# EAGLE schematic LEDboard (EAGLE 7.6.0)
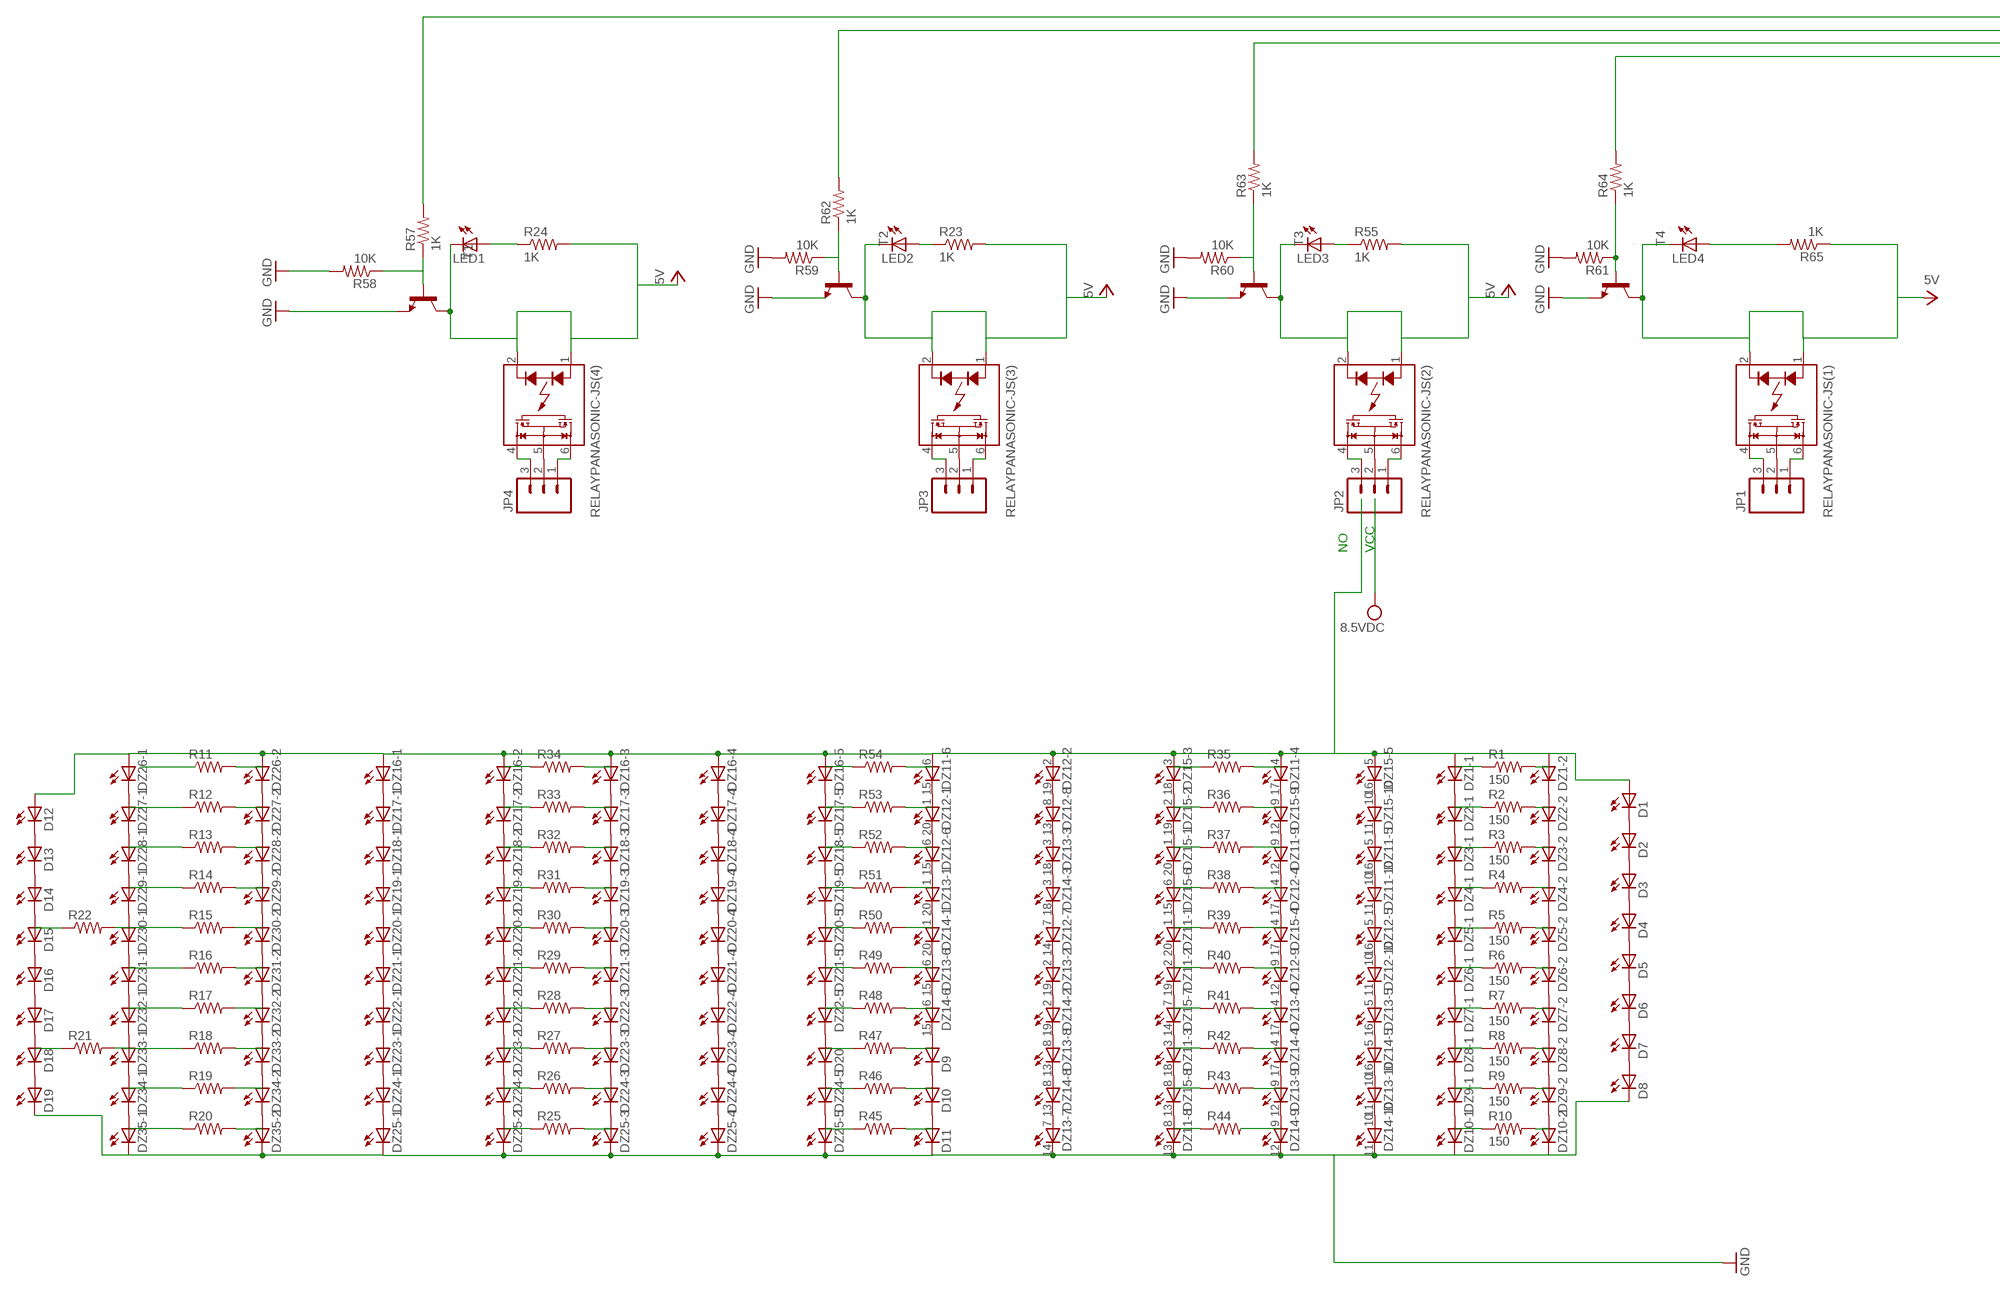
[diagram p0: schematic, sheet 1, part 1 of 2]
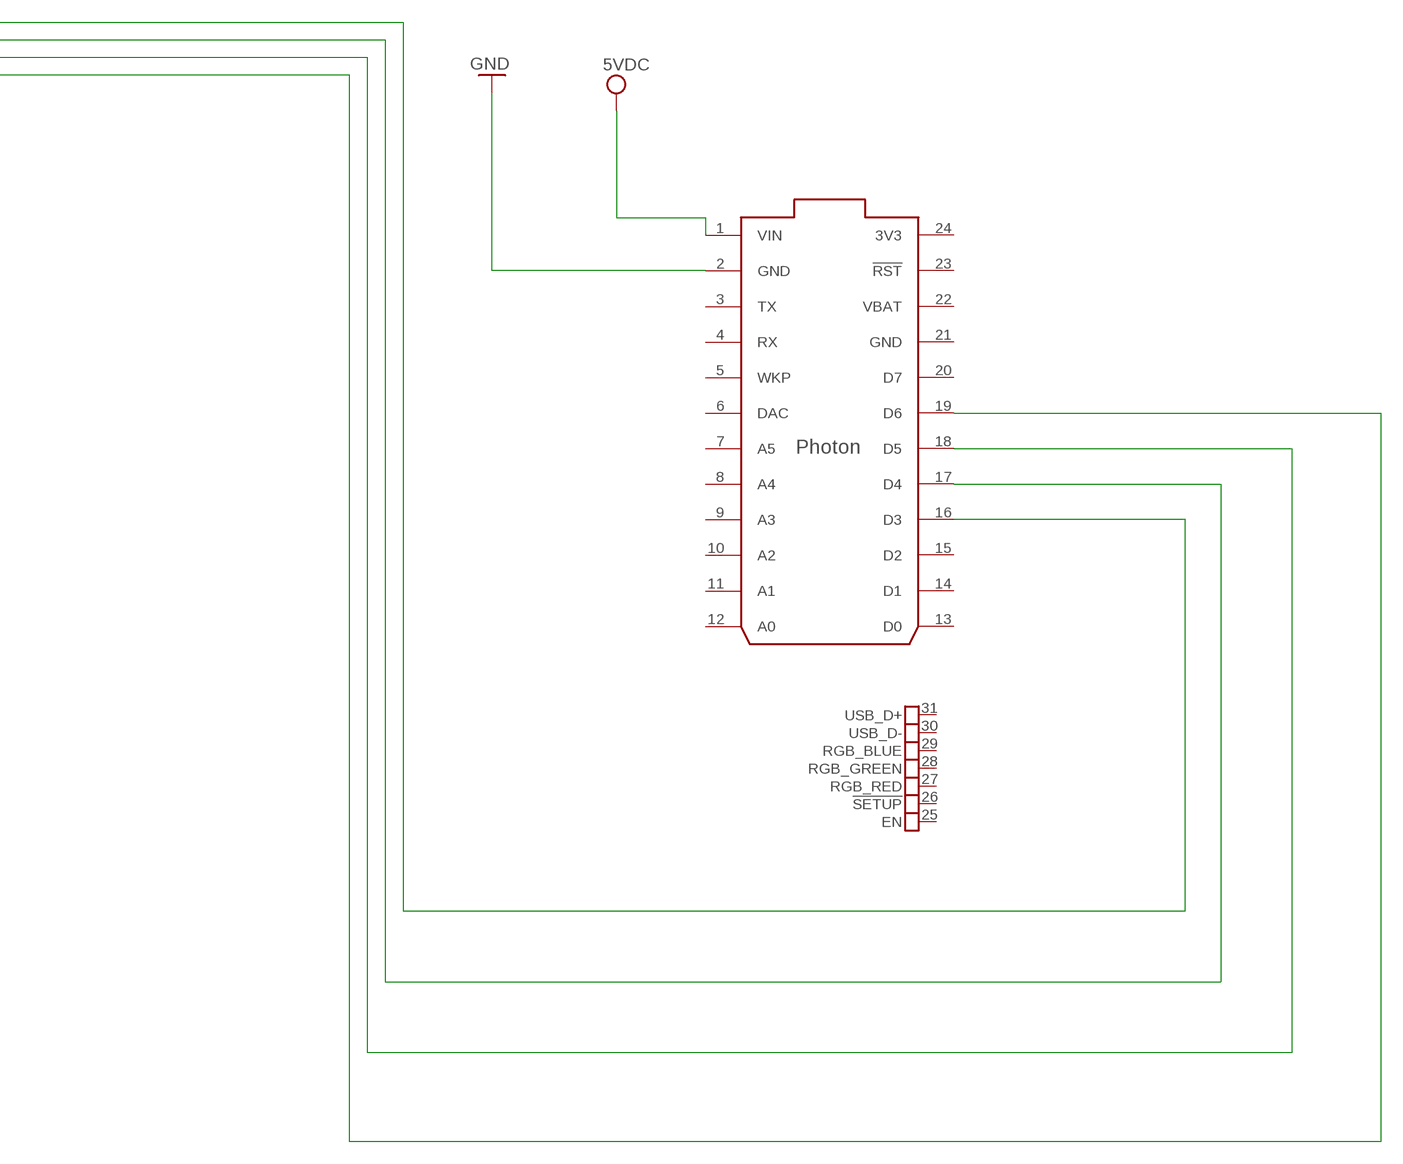
[diagram p1: schematic, sheet 1, part 2 of 2]

## Parts
D1  U57X32  [U57X32]
D2  U57X32  [U57X32]
D3  U57X32  [U57X32]
D4  U57X32  [U57X32]
D5  U57X32  [U57X32]
D6  U57X32  [U57X32]
D7  U57X32  [U57X32]
D8  U57X32  [U57X32]
D9  U57X32  [U57X32]
D10  U57X32  [U57X32]
D11  U57X32  [U57X32]
D12  U57X32  [U57X32]
D13  U57X32  [U57X32]
D14  U57X32  [U57X32]
D15  U57X32  [U57X32]
D16  U57X32  [U57X32]
D17  U57X32  [U57X32]
D18  U57X32  [U57X32]
D19  U57X32  [U57X32]
D20  U57X32  [U57X32]
DZ1  LZR182  [LZR182]
DZ2  LZR182  [LZR182]
DZ3  LZR182  [LZR182]
DZ4  LZR182  [LZR182]
DZ5  LZR182  [LZR182]
DZ6  LZR182  [LZR182]
DZ7  LZR182  [LZR182]
DZ8  LZR182  [LZR182]
DZ9  LZR182  [LZR182]
DZ10  LZR182  [LZR182]
DZ11  LB10  [LB10]
DZ12  LB10  [LB10]
DZ13  LB10  [LB10]
DZ14  LB10  [LB10]
DZ15  LB10  [LB10]
DZ16  LZR185  [LZR185]
DZ17  LZR185  [LZR185]
DZ18  LZR185  [LZR185]
DZ19  LZR185  [LZR185]
DZ20  LZR185  [LZR185]
DZ21  LZR185  [LZR185]
DZ22  LZR185  [LZR185]
DZ23  LZR185  [LZR185]
DZ24  LZR185  [LZR185]
DZ25  LZR185  [LZR185]
DZ26  LZR182  [LZR182]
DZ27  LZR182  [LZR182]
DZ28  LZR182  [LZR182]
DZ29  LZR182  [LZR182]
DZ30  LZR182  [LZR182]
DZ31  LZR182  [LZR182]
DZ32  LZR182  [LZR182]
DZ33  LZR182  [LZR182]
DZ34  LZR182  [LZR182]
DZ35  LZR182  [LZR182]
JP1  M03  [03P]
JP2  M03  [03P]
JP3  M03  [03P]
JP4  M03  [03P]
LED1  LEDLUMILED  [LUMILED]
LED2  LEDLUMILED  [LUMILED]
LED3  LEDLUMILED  [LUMILED]
LED4  LEDLUMILED  [LUMILED]
R1  150  R-US_0204/2V  [0204V]
R2  150  R-US_0204/2V  [0204V]
R3  150  R-US_0204/2V  [0204V]
R4  R-US_0204/2V  [0204V]
R5  150  R-US_0204/2V  [0204V]
R6  150  R-US_0204/2V  [0204V]
R7  150  R-US_0204/2V  [0204V]
R8  150  R-US_0204/2V  [0204V]
R9  150  R-US_0204/2V  [0204V]
R10  150  R-US_0204/2V  [0204V]
R11  R-US_0204/2V  [0204V]
R12  R-US_0204/2V  [0204V]
R13  R-US_0204/2V  [0204V]
R14  R-US_0204/2V  [0204V]
R15  R-US_0204/2V  [0204V]
R16  R-US_0204/2V  [0204V]
R17  R-US_0204/2V  [0204V]
R18  R-US_0204/2V  [0204V]
R19  R-US_0204/2V  [0204V]
R20  R-US_0204/2V  [0204V]
R21  R-US_0204/2V  [0204V]
R22  R-US_0204/2V  [0204V]
R23  1K  R-US_0204/2V  [0204V]
R24  1K  R-US_0204/2V  [0204V]
R25  R-US_0204/2V  [0204V]
R26  R-US_0204/2V  [0204V]
R27  R-US_0204/2V  [0204V]
R28  R-US_0204/2V  [0204V]
R29  R-US_0204/2V  [0204V]
R30  R-US_0204/2V  [0204V]
R31  R-US_0204/2V  [0204V]
R32  R-US_0204/2V  [0204V]
R33  R-US_0204/2V  [0204V]
R34  R-US_0204/2V  [0204V]
R35  R-US_0204/2V  [0204V]
R36  R-US_0204/2V  [0204V]
R37  R-US_0204/2V  [0204V]
R38  R-US_0204/2V  [0204V]
R39  R-US_0204/2V  [0204V]
R40  R-US_0204/2V  [0204V]
R41  R-US_0204/2V  [0204V]
R42  R-US_0204/2V  [0204V]
R43  R-US_0204/2V  [0204V]
R44  R-US_0204/2V  [0204V]
R45  R-US_0204/2V  [0204V]
R46  R-US_0204/2V  [0204V]
R47  R-US_0204/2V  [0204V]
R48  R-US_0204/2V  [0204V]
R49  R-US_0204/2V  [0204V]
R50  R-US_0204/2V  [0204V]
R51  R-US_0204/2V  [0204V]
R52  R-US_0204/2V  [0204V]
R53  R-US_0204/2V  [0204V]
R54  R-US_0204/2V  [0204V]
R55  1K  R-US_0204/2V  [0204V]
R57  1K  R-US_0204/2V  [0204V]
R58  10K  R-US_0204/2V  [0204V]
R59  10K  R-US_0204/2V  [0204V]
R60  10K  R-US_0204/2V  [0204V]
R61  10K  R-US_0204/2V  [0204V]
R62  1K  R-US_0204/2V  [0204V]
R63  1K  R-US_0204/2V  [0204V]
R64  1K  R-US_0204/2V  [0204V]
R65  1K  R-US_0204/2V  [0204V]
RELAYPANASONIC-JS(1)  AQV10  [DIL06]
RELAYPANASONIC-JS(2)  AQV10  [DIL06]
RELAYPANASONIC-JS(3)  AQV10  [DIL06]
RELAYPANASONIC-JS(4)  AQV10  [DIL06]
T1  -NPN-SOT93V  [SOT93V]
T2  -NPN-SOT93V  [SOT93V]
T3  -NPN-SOT93V  [SOT93V]
T4  -NPN-SOT93V  [SOT93V]
U$1  PHOTON_SMD  [PHOTON_SMD]

## Nets
GND: D8.K(C) D11.K(C) D19.K(C) DZ10.K1(-1:C) DZ10.K2(-2:C) DZ11.13(-8:C) DZ13.14(-7:C) DZ14.11(-10:C) DZ14.12(-9:C) DZ25.K1(-1:C) DZ25.K2(-2:C) DZ25.K3(-3:C) DZ25.K4(-4:C) DZ25.K5(-5:C) DZ35.K1(-1:C) DZ35.K2(-2:C) R58.2 R59.2 R60.2 R61.2 T1.E T3.E T4.E U$1.2(GND)
N$1: D1.K(C) D2.A
N$2: D2.K(C) D3.A
N$3: D3.K(C) D4.A
N$4: D4.K(C) D5.A
N$5: D5.K(C) D6.A
N$6: D6.K(C) D7.A
N$7: D7.K(C) D8.A
N$8: R35.1
N$9: DZ1.K1(-1:C) DZ2.A1(-1:A)
N$10: DZ1.K2(-2:C) DZ2.A2(-2:A)
N$11: DZ2.K1(-1:C) DZ3.A1(-1:A)
N$12: DZ2.K2(-2:C) DZ3.A2(-2:A)
N$13: DZ3.K1(-1:C) DZ4.A1(-1:A)
N$14: DZ3.K2(-2:C) DZ4.A2(-2:A)
N$15: DZ4.K1(-1:C) DZ5.A1(-1:A)
N$16: DZ4.K2(-2:C) DZ5.A2(-2:A)
N$17: DZ5.K1(-1:C) DZ6.A1(-1:A)
N$18: DZ5.K2(-2:C) DZ6.A2(-2:A)
N$19: DZ6.K1(-1:C) DZ7.A1(-1:A)
N$20: DZ6.K2(-2:C) DZ7.A2(-2:A)
N$21: DZ7.K1(-1:C) DZ8.A1(-1:A)
N$22: DZ7.K2(-2:C) DZ8.A2(-2:A)
N$23: DZ8.K1(-1:C) DZ9.A1(-1:A)
N$24: DZ8.K2(-2:C) DZ9.A2(-2:A)
N$25: DZ9.K1(-1:C) DZ10.A1(-1:A)
N$26: DZ9.K2(-2:C) DZ10.A2(-2:A)
N$27: R35.2
N$28: R1.1
N$29: R1.2
N$30: R2.2
N$31: R2.1
N$32: R3.1
N$33: R3.2
N$34: R4.2
N$35: R4.1
N$36: R5.1
N$37: R5.2
N$38: R6.2
N$39: R6.1
N$40: R7.1
N$41: R7.2
N$42: R8.2
N$43: R8.1
N$44: R9.1
N$45: R9.2
N$46: R10.2
N$47: R10.1
N$48: DZ11.15(-6:C) DZ12.1(-1:A)
N$49: DZ12.8(-8:A) DZ12.19(-2:C)
N$50: DZ12.7(-7:A) DZ14.18(-3:C)
N$51: DZ11.12(-9:C) DZ12.4(-4:A)
N$52: DZ11.11(-10:C) DZ12.5(-5:A)
N$53: DZ12.15(-6:C) DZ13.1(-1:A)
N$54: DZ12.14(-7:C) DZ13.2(-2:A)
N$55: DZ12.13(-8:C) DZ13.3(-3:A)
N$56: DZ12.12(-9:C) DZ13.4(-4:A)
N$57: DZ12.11(-10:C) DZ13.5(-5:A)
N$58: DZ13.20(-1:C) DZ14.1(-1:A)
N$59: DZ13.19(-2:C) DZ14.2(-2:A)
N$60: DZ13.18(-3:C) DZ14.3(-3:A)
N$61: DZ13.17(-4:C) DZ14.4(-4:A)
N$62: DZ13.16(-5:C) DZ14.5(-5:A)
N$63: DZ13.15(-6:C) DZ14.6(-6:A)
N$64: DZ12.6(-6:A) DZ12.20(-1:C)
N$65: DZ13.13(-8:C) DZ14.8(-8:A)
N$66: DZ13.12(-9:C) DZ14.9(-9:A)
N$67: DZ13.11(-10:C) DZ14.10(-10:A)
N$68: DZ15.6(-6:A) DZ15.20(-1:C)
N$69: DZ12.10(-10:A) DZ12.16(-5:C)
N$70: DZ15.10(-10:A) DZ15.16(-5:C)
N$71: DZ11.5(-5:A) DZ15.11(-10:C)
N$72: DZ11.10(-10:A) DZ11.16(-5:C)
N$73: DZ13.10(-10:A) DZ14.16(-5:C)
N$74: DZ11.17(-4:C) DZ15.9(-9:A)
N$75: DZ11.9(-9:A) DZ15.12(-9:C)
N$76: DZ12.17(-4:C) DZ15.4(-4:A)
N$77: DZ12.9(-9:A) DZ15.17(-4:C)
N$78: DZ13.9(-9:A) DZ14.17(-4:C)
N$79: DZ11.18(-3:C) DZ15.8(-8:A)
N$80: DZ15.2(-2:A) DZ15.18(-3:C)
N$81: DZ15.1(-1:A) DZ15.19(-2:C)
N$82: DZ11.1(-1:A) DZ15.15(-6:C)
N$83: DZ11.2(-2:A) DZ11.20(-1:C)
N$84: DZ11.19(-2:C) DZ15.7(-7:A)
N$85: DZ11.3(-3:A) DZ15.14(-7:C)
N$86: DZ11.8(-8:A) DZ15.13(-8:C)
N$87: DZ13.8(-8:A) DZ14.19(-2:C)
N$88: DZ13.7(-7:A) DZ14.13(-8:C)
N$89: DZ13.6(-6:A) DZ14.20(-1:C)
N$90: D9.A DZ14.15(-6:C)
N$91: D9.K(C) D10.A
N$92: D10.K(C) D11.A
N$93: DZ16.K1(-1:C) DZ17.A1(-1:A)
N$94: DZ16.K2(-2:C) DZ17.A2(-2:A)
N$95: DZ16.K3(-3:C) DZ17.A3(-3:A)
N$96: DZ16.K4(-4:C) DZ17.A4(-4:A)
N$97: DZ16.K5(-5:C) DZ17.A5(-5:A)
N$98: DZ17.K1(-1:C) DZ18.A1(-1:A)
N$99: DZ17.K2(-2:C) DZ18.A2(-2:A)
N$100: DZ17.K3(-3:C) DZ18.A3(-3:A)
N$101: DZ17.K4(-4:C) DZ18.A4(-4:A)
N$102: DZ17.K5(-5:C) DZ18.A5(-5:A)
N$103: DZ18.K1(-1:C) DZ19.A1(-1:A)
N$104: DZ18.K2(-2:C) DZ19.A2(-2:A)
N$105: DZ18.K3(-3:C) DZ19.A3(-3:A)
N$106: DZ18.K4(-4:C) DZ19.A4(-4:A)
N$107: DZ18.K5(-5:C) DZ19.A5(-5:A)
N$108: DZ19.K1(-1:C) DZ20.A1(-1:A)
N$109: DZ19.K2(-2:C) DZ20.A2(-2:A)
N$110: DZ19.K3(-3:C) DZ20.A3(-3:A)
N$111: DZ19.K4(-4:C) DZ20.A4(-4:A)
N$112: DZ19.K5(-5:C) DZ20.A5(-5:A)
N$113: DZ20.K1(-1:C) DZ21.A1(-1:A)
N$114: DZ20.K2(-2:C) DZ21.A2(-2:A)
N$115: DZ20.K3(-3:C) DZ21.A3(-3:A)
N$116: DZ20.K4(-4:C) DZ21.A4(-4:A)
N$117: DZ20.K5(-5:C) DZ21.A5(-5:A)
N$118: DZ21.K1(-1:C) DZ22.A1(-1:A)
N$119: DZ21.K2(-2:C) DZ22.A2(-2:A)
N$120: DZ21.K3(-3:C) DZ22.A3(-3:A)
N$121: DZ21.K4(-4:C) DZ22.A4(-4:A)
N$122: DZ21.K5(-5:C) DZ22.A5(-5:A)
N$123: DZ22.K1(-1:C) DZ23.A1(-1:A)
N$124: DZ22.K2(-2:C) DZ23.A2(-2:A)
N$125: DZ22.K3(-3:C) DZ23.A3(-3:A)
N$126: DZ22.K4(-4:C) DZ23.A4(-4:A)
N$127: D20.A DZ22.K5(-5:C)
N$128: DZ23.K1(-1:C) DZ24.A1(-1:A)
N$129: DZ23.K2(-2:C) DZ24.A2(-2:A)
N$130: DZ23.K3(-3:C) DZ24.A3(-3:A)
N$131: DZ23.K4(-4:C) DZ24.A4(-4:A)
N$132: D20.K(C) DZ24.A5(-5:A)
N$133: DZ24.K1(-1:C) DZ25.A1(-1:A)
N$134: DZ24.K2(-2:C) DZ25.A2(-2:A)
N$135: DZ24.K3(-3:C) DZ25.A3(-3:A)
N$136: DZ24.K4(-4:C) DZ25.A4(-4:A)
N$137: DZ24.K5(-5:C) DZ25.A5(-5:A)
N$138: DZ26.K1(-1:C) DZ27.A1(-1:A)
N$139: DZ26.K2(-2:C) DZ27.A2(-2:A)
N$140: DZ27.K1(-1:C) DZ28.A1(-1:A)
N$141: DZ27.K2(-2:C) DZ28.A2(-2:A)
N$142: DZ28.K1(-1:C) DZ29.A1(-1:A)
N$143: DZ28.K2(-2:C) DZ29.A2(-2:A)
N$144: DZ29.K1(-1:C) DZ30.A1(-1:A)
N$145: DZ29.K2(-2:C) DZ30.A2(-2:A)
N$146: DZ30.K1(-1:C) DZ31.A1(-1:A)
N$147: DZ30.K2(-2:C) DZ31.A2(-2:A)
N$148: DZ31.K1(-1:C) DZ32.A1(-1:A)
N$149: DZ31.K2(-2:C) DZ32.A2(-2:A)
N$150: DZ32.K1(-1:C) DZ33.A1(-1:A)
N$151: DZ32.K2(-2:C) DZ33.A2(-2:A)
N$152: DZ33.K1(-1:C) DZ34.A1(-1:A)
N$153: DZ33.K2(-2:C) DZ34.A2(-2:A)
N$154: DZ34.K1(-1:C) DZ35.A1(-1:A)
N$155: DZ34.K2(-2:C) DZ35.A2(-2:A)
N$156: D12.K(C) D13.A
N$157: D13.K(C) D14.A
N$158: D14.K(C) D15.A
N$159: D15.K(C) D16.A
N$160: D16.K(C) D17.A
N$161: D17.K(C) D18.A
N$162: D18.K(C) D19.A
N$163: R36.2
N$164: R36.1
N$165: R37.1
N$166: R37.2
N$167: R38.2
N$168: R38.1
N$169: R39.1
N$170: R39.2
N$171: R40.2
N$172: R40.1
N$173: R41.2
N$174: R41.1
N$175: R42.1
N$176: R42.2
N$177: R43.2
N$178: R43.1
N$179: R44.1
N$181: R45.2
N$182: R45.1
N$183: R46.1
N$185: R47.2
N$186: R46.2
N$187: R48.1
N$188: R48.2
N$189: R49.2
N$190: R49.1
N$191: R50.1
N$192: R50.2
N$193: R51.2
N$194: R51.1
N$195: R52.1
N$196: R53.1
N$197: R54.1
N$198: R54.2
N$199: R53.2
N$200: R52.2
N$201: R34.2
N$202: R34.1
N$203: R33.1
N$204: R33.2
N$205: R32.2
N$206: R32.1
N$207: R31.1
N$208: R31.2
N$209: R30.2
N$210: R29.2
N$211: R28.2
N$212: R27.2
N$213: R26.2
N$214: R25.2
N$215: R25.1
N$216: R26.1
N$217: R27.1
N$218: R28.1
N$219: R29.1
N$220: R30.1
N$221: R20.2
N$222: R19.2
N$223: R19.1
N$224: R20.1
N$225: R18.1 R21.2
N$226: R18.2
N$227: R17.2
N$228: R17.1
N$229: R16.1
N$230: R16.2
N$231: R15.2
N$232: R15.1 R22.2
N$233: R14.1
N$234: R14.2
N$235: R13.2
N$236: R13.1
N$237: R12.1
N$238: R12.2
N$240: R11.2
N$241: R22.1
N$242: R21.1
N$243: JP2.2 RELAYPANASONIC-JS(2).5(S)
N$244: JP3.2 RELAYPANASONIC-JS(3).5(S)
N$245: JP4.2 RELAYPANASONIC-JS(4).5(S)
N$246: JP1.2 RELAYPANASONIC-JS(1).5(S)
N$247: R63.2 U$1.18(D5)
N$248: JP4.1 RELAYPANASONIC-JS(4).6(D1)
N$249: JP3.3 RELAYPANASONIC-JS(3).4(D2)
N$250: JP3.1 RELAYPANASONIC-JS(3).6(D1)
N$251: JP2.3 RELAYPANASONIC-JS(2).4(D2)
N$252: JP2.1 RELAYPANASONIC-JS(2).6(D1)
N$253: JP1.3 RELAYPANASONIC-JS(1).4(D2)
N$254: JP1.1 RELAYPANASONIC-JS(1).6(D1)
N$255: R64.2 U$1.19(D6)
N$256: R57.1 R58.1 T1.B
N$257: LED1.2+(A) R24.1
N$258: R57.2 U$1.16(D3)
N$259: LED2.2+(A) R23.1
N$260: LED3.2+(A) R55.1
N$261: LED4.2+(A) R65.2
N$262: R59.1 R62.1 T2.B
N$263: R62.2 U$1.17(D4)
N$264: R61.1 R64.1 T4.B
N$265: R60.1 R63.1 T3.B
NO: D1.A D12.A DZ1.A1(-1:A) DZ1.A2(-2:A) DZ11.4(-4:A) DZ11.6(-6:A) DZ12.2(-2:A) DZ15.3(-3:A) DZ15.5(-5:A) DZ16.A1(-1:A) DZ16.A2(-2:A) DZ16.A3(-3:A) DZ16.A4(-4:A) DZ16.A5(-5:A) DZ26.A1(-1:A) DZ26.A2(-2:A)
RELAYPANASONIC-JS(4): JP4.3 RELAYPANASONIC-JS(4).4(D2)
VCC: LED1.4-(C) LED2.4-(C) LED3.4-(C) LED4.4-(C) R23.2 R24.2 R55.2 R65.1 RELAYPANASONIC-JS(1).1(A) RELAYPANASONIC-JS(1).2(K) RELAYPANASONIC-JS(2).1(A) RELAYPANASONIC-JS(2).2(K) RELAYPANASONIC-JS(3).1(A) RELAYPANASONIC-JS(3).2(K) RELAYPANASONIC-JS(4).1(A) RELAYPANASONIC-JS(4).2(K) T1.C T2.C T3.C T4.C U$1.1(VIN) ; supply symbol labelled 5VDC, 5V, 8.5VDC
Unconnected: DZ11.7(-7:A) DZ11.14(-7:C) DZ12.3(-3:A) DZ12.18(-3:C) DZ14.7(-7:A) DZ14.14(-7:C) DZ23.A5(-5:A) DZ23.K5(-5:C) R11.1 R44.2 R47.1 T2.E U$1.3(TX) U$1.4(RX) U$1.5(WKP) U$1.6(DAC) U$1.7(A5) U$1.8(A4) U$1.9(A3) U$1.10(A2) U$1.11(A1) U$1.12(A0) U$1.13(D0) U$1.14(D1) U$1.15(D2) U$1.20(D7) U$1.23(!RST) U$1.25(EN) U$1.26(!SETUP) U$1.27(RGB_RED) U$1.28(RGB_GREEN) U$1.29(RGB_BLUE) U$1.30(USB_D-) U$1.31(USB_D+)

## Notes on the sheet
- NO | VCC

## Power pins joined to a net without a drawn wire
3V3: U$1.24(3V3)
GND: U$1.21(GND)
VBAT: U$1.22(VBAT)

## Library data of the parts
D1-D20 = led:U57X32: LED rectangle, 5.7 x 3.2 mm
DZ1-DZ10 DZ26-DZ35 = led:LZR182: LED BLOCK 2 LEDs, Siemens
DZ11-DZ15 = led:LB10: LED BLOCK 10-LED bar graph, DIL, Siemens
DZ16-DZ25 = led:LZR185: LED BLOCK 5 LEDs, Siemens
JP1-JP4 = con-amp-quick:M03: AMP QUICK CONNECTOR; OC_FARNELL: unknown; OC_NEWARK: unknown
LED1-LED4 = led-lumiled:LED: LED - LUMILED® LXK2-PW12-R00, LXK2-PW12-S00, LXK2-PW14-U00, LXK2-PW14-V00 LXK2-PM12-R00, LXK2-PM12-S00, LXK2-PM14-U00 LXK2-PE12-Q00, LXK2-PE12-R00, LXK2-PE12-S00, LXK2-PE14-T00, LXK2-PE14-U00 LXK2-PB12-K00, LXK2-PB12-L00, LXK2-PB12-M00, LXK2-PB14-N00, LXK2-PB14-P00, LXK2-PB14-Q00 LXK2-PR12-L00, LXK2-PR12-M00, LXK2-PR14-Q00, LXK2-PR14-R00 LXK2-PD12-Q00, LXK2-PD12-R00, LXK2-PD12-S00 LXK2-PH12-R00, LXK2-PH12-S00 LXK2-PL12-P00, LXK2-PL12-Q00, LXK2-PL12-R00 Source: www.luxeon.com; OC_FARNELL: unknown; OC_NEWARK: unknown
R1-R22 R25-R54 R57-R61 = resistor:R-US_: RESISTOR, American symbol
R23 R24 R55 R62-R65 = rcl:R-US_: RESISTOR, American symbol
RELAYPANASONIC-JS(1) RELAYPANASONIC-JS(2) RELAYPANASONIC-JS(3) RELAYPANASONIC-JS(4) = relay:AQV*: PhotoMOS Relay NAiS Source: Data sheet <http://www.panasonic-electric-works.com/catalogues/downloads/photomos/ds_x615_en_aqv10_20.pdf>; MF: AROMAT/ MATSUSHITA; MPN: AQV102; OC_FARNELL: 2006029; OC_NEWARK: 94F8718
T1-T4 = transistor:*-NPN-: NPN Transistror BF959 corrected 2008.03.06
U$1 = Spark:PHOTON_SMD: Photon (without headers) - designed to be surface mounted with 7 extra exposed pads on the bottom of the board which include, 3 RGB LED outputs, /SETUP, EN (3.3V SMPS enable input), USB D+ and USB D-.